# Altium project Lathe_mainboard.PrjPcb
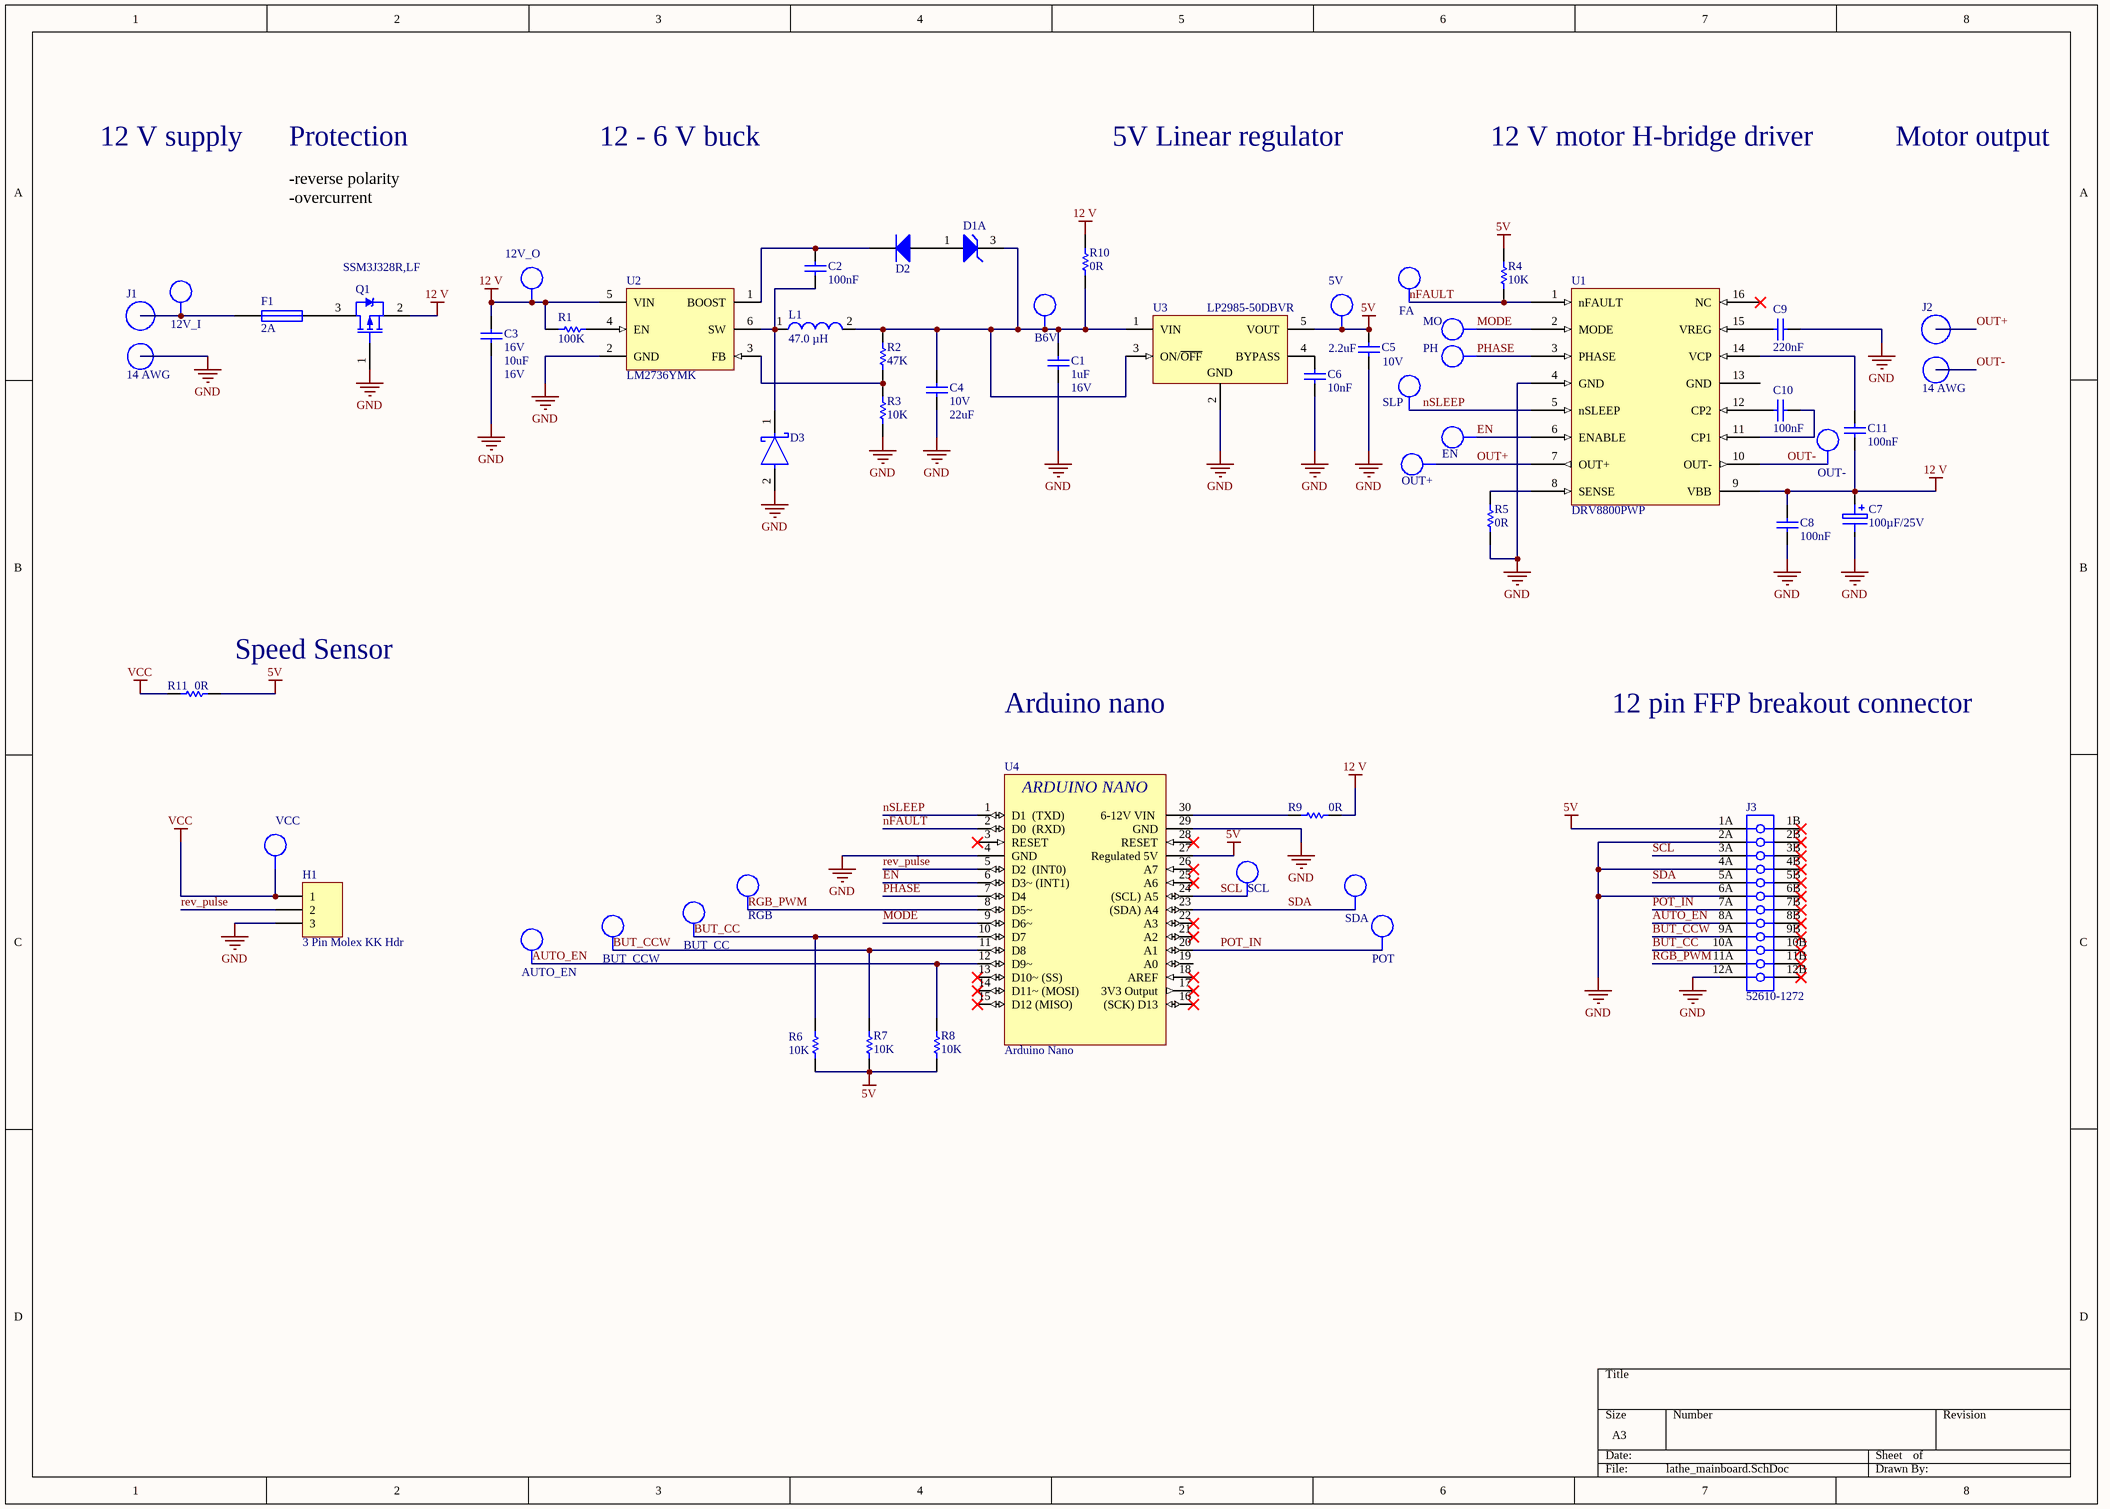
[diagram p0: lathe_mainboard.SchDoc]
1 sheet, 55 parts. Net scope: global (net labels, ports and power ports of the same name join across sheets).
Board file: lathe_pcb.PcbDoc

## Sheet lathe_mainboard.SchDoc
size A3; SheetNumber: 1; SheetTotal: 1; SPICEModelCacheIQLMAAGZ: <root> / <DocumentId>IQLMAAGZ</DocumentId> / <CacheFrame Number="0"> / <Model Name="cap" Kind="MDL"> / <Text>*Default semiconductor capacitor / .MODEL CAP C()</Text> / </Model> / </CacheFrame> / </root>

### Parts
5V  TP  [TP_1206]  (value not drawn)  (no BOM)
12V_I  TP  [TP_1206]  (value not drawn)  (no BOM)
12V_O  TP  [TP_1206]  (value not drawn)  (no BOM)
AUTO_EN  TP  [TP_1206]  (value not drawn)  (no BOM)
B6V  TP  [TP_1206]  (value not drawn)  (no BOM)
BUT_CC  TP  [TP_1206]  (value not drawn)  (no BOM)
BUT_CCW  TP  [TP_1206]  (value not drawn)  (no BOM)
C1  Max Voltage: 16V  [CAPC1608L]  (hidden comment: 1uF)
C2  100nF  [CAPC1608L]
C3  Voltage - Rated: 16V  [CAPC2012L]  (hidden comment: 10uF)
C4  Max Voltage: 10V  [CAPC3216L]  (hidden comment: 22uF)
C5  Max Voltage: 10V  [CAPC1608L]  (hidden comment: 2.2uF)
C6  10nF  [CAPC1608L]
C7  100µF/25V  [CAPAE6666X77M]
C8  100nF  [CAPC1608L]
C9  220nF  [CAPC1608L]
C10  100nF  [CAPC1608L]
C11  100nF  [CAPC1608L]
D1  BZX84C4V3LT1G  [ONSC-SOT-23-3-318-08_V]  (value not drawn)  (part A of 2)
D2  1N4148W-7-F  [DIOD-SOD123-2_V]  (value not drawn)
D3  MSS1P3L-M3/89A  [FP-96591-MFG]  (value not drawn)
EN  TP  [TP_1206]  (value not drawn)  (no BOM)
F1  value 2A  [RESC3216N]  (hidden comment: 1A)
FA  TP  [TP_1206]  (value not drawn)  (no BOM)
H1  3 Pin Molex KK Hdr  [MOLEX_KK_3_HDR]
J1  14 AWG  [14AWG_holes]
J2  14 AWG  [14AWG_holes]
J3  52610-1272  [MOLX-52610-1272]
L1  47.0 µH  [WE-PD-L]
MO  TP  [TP_1206]  (value not drawn)  (no BOM)
OUT+  TP  [TP_1206]  (value not drawn)  (no BOM)
OUT-  TP  [TP_1206]  (value not drawn)  (no BOM)
PH  TP  [TP_1206]  (value not drawn)  (no BOM)
POT  TP  [TP_1206]  (value not drawn)  (no BOM)
Q1  SSM3J328R,LF  [SOT23_L]
R1  100K  [RESC1608L]
R2  47K  [RESC1608N]
R3  10K  [RESC1608L]
R4  10K  [RESC1608L]
R5  0R  [RESC1608L]
R6  10K  [RESC1608L]
R7  10K  [RESC1608L]
R8  10K  [RESC1608L]
R9  0R  [RESC1608L]
R10  0R  [RESC1608L]
R11  0R  [RESC1608L]
RGB  TP  [TP_1206]  (value not drawn)  (no BOM)
SCL  TP  [TP_1206]  (value not drawn)  (no BOM)
SDA  TP  [TP_1206]  (value not drawn)  (no BOM)
SLP  TP  [TP_1206]  (value not drawn)  (no BOM)
U1  DRV8800PWP  [SOP65P640X120-17N]
U2  LM2736YMK  [DDC0006A_L]
U3  LP2985-50DBVR  [DBV0005A_M]
U4  Arduino Nano  [Arduino-nano]
VCC  TP  [TP_1206]  (value not drawn)  (no BOM)

### Nets
5V: 5V.1 C5.2 J3.1A R4.2 R6.1 R7.1 R8.1 R11.2 U3.5(VOUT) U4.27(Regulated_5V)
12 V: 12V_O.1 C3.2 C7.2 C8.2 C11.1 Q1.2 R1.2 R9.2 R10.2 U1.9(VBB) U2.5(VIN)
GND: C1.1 C3.1 C4.1 C5.1 C6.1 C7.1 C8.1 C9.2 D3.2(A) H1.3 J1.2 J3.2A J3.4A J3.6A J3.12A Q1.1 R3.1 R5.1 U1.4(GND) U2.2(GND) U3.2(GND) U4.4(GND) U4.29(GND)
VCC: H1.1 R11.1 VCC.1
AUTO_EN: AUTO_EN.1 J3.8A R8.2 U4.12(D9~)
BUT_CC: BUT_CC.1 J3.10A R6.2 U4.10(D7)
BUT_CCW: BUT_CCW.1 J3.9A R7.2 U4.11(D8)
EN: EN.1 U1.6(ENABLE) U4.6(D3~_(INT1))
MODE: MO.1 U1.2(MODE) U4.9(D6~)
nFAULT: FA.1 R4.1 U1.1(nFAULT) U4.2(D0__(RXD))
nSLEEP: SLP.1 U1.5(nSLEEP) U4.1(D1__(TXD))
OUT+: J2.1 OUT+.1 U1.7(OUT+)
OUT-: J2.2 OUT-.1 U1.10(OUT-)
PHASE: PH.1 U1.3(PHASE) U4.7(D4)
POT_IN: J3.7A POT.1 U4.20(A1)
rev_pulse: H1.2 U4.5(D2__(INT0))
RGB_PWM: J3.11A RGB.1 U4.8(D5~)
SCL: J3.3A SCL.1 U4.24((SCL)_A5)
SDA: J3.5A SDA.1 U4.23((SDA)_A4)
Net12V_I_1: 12V_I.1 F1.1 J1.1
NetB6V_1: B6V.1 C1.2 C4.2 D1.3(K) L1.2 R2.2 R10.1 U3.1(VIN) U3.3(ON/~{OFF})
NetC2_1: C2.1 D2.2(K) U2.1(BOOST)
NetC2_2: C2.2 D3.1(C) L1.1 U2.6(SW)
NetC6_2: C6.2 U3.4(BYPASS)
NetC9_1: C9.1 U1.15(VREG)
NetC10_1: C10.1 U1.11(CP1)
NetC10_2: C10.2 U1.12(CP2)
NetC11_2: C11.2 U1.14(VCP)
NetD1_1: D1.1(A) D2.1(A)
NetF1_2: F1.2 Q1.3
NetR1_1: R1.1 U2.4(EN)
NetR2_1: R2.1 R3.2 U2.3(FB)
NetR5_2: R5.2 U1.8(SENSE)
NetR9_1: R9.1 U4.30(6-12V_VIN)

Not connected (* = marked no-connect by the designer): J3 1B* 2B* 3B* 4B* 5B* 6B* 7B* 8B* 9B* 10B* 11B* 12B*; U1 13(GND) 16(NC)*; U4 3(RESET)* 13(D10~_(SS))* 14(D11~_(MOSI))* 15(D12_(MISO))* 16((SCK)_D13)* 17(3V3_Output)* 18(AREF)* 19(A0) 21(A2)* 22(A3)* 25(A6)* 26(A7)* 28(RESET)*

### Notes on the sheet
- 12 V supply
- Protection
- 12 - 6 V buck
- 5V Linear regulator
- 12 V motor H-bridge driver
- Motor output
- -reverse polarity
  -overcurrent
- (near R11) Speed Sensor
- Arduino nano
- 12 pin FFP breakout connector
- (in symbol Arduino Nano) ARDUINO NANO

### Library data of the parts
5V 12V_I 12V_O AUTO_EN B6V BUT_CC BUT_CCW EN FA MO OUT+ OUT- PH POT RGB SCL SDA SLP VCC = TP_1206: Test-Point 3.3x1.6x2.1mm SMD; Manufacturer: Harwin Inc; Manufacturer Part Number: S1751-46R; Manufacturer PN: *; Storage Location: ProtoPlace; Mounting Type: Surface Mount; Type: PC Test Point; Supplier 1: Digi-Key; Supplier Part Number 1: 952-1478-2-ND; Supplier 2: Farnell; Supplier Part Number 2: 1826282; Supplier: ECE Dept; Value: TP
C1 = CC_1uF_0603: CAP CER 1uF Y5V -20% +80% 16V 0603; PackageReference: 0603; Code_IPC: 1608 [0603]; Verify: *; Supplier: ECE Dept; Storage Location: PCB Assembly WS; Value: 1uF
C2 C8 C10 C11 = CC_100nF_0603: CAP CER 100nF X7R +-10% 50V 0603; PackageReference: 0603; Code_IPC: 1608 [0603]; Verify: *; Supplier: ECE Dept; Storage Location: PCB Assembly WS; Value: 100nF
C3 = CC_10uF_0805_16V: CAP CER 10uF X5R 16V 0805; Manufacturer: Samsung Electro-Mechanics; Manufacturer Part Number: CL21A106KOQNNWE; Note: Footprint corresponds to dimensions for bulk cassette packaging. This case size has tightened tolerances.; Tolerance: ±10%; Notification: Current market demand for these product types have resulted in fluctuating and extending lead times. Lead times may differ.; PackageReference: 0805; Code_IPC: 2012[0805]; Supplier 1: Digi-Key; RoHS: RoHS Compliant; Category: Capacitors; Stock 1: 20000; Pricing 1: 1=0.35, 10=0.25, 100=0.1178, 500=0.08254, 1000=0.06831 (NZD); Packaging: Cut Tape (CT); Part Status: Active; Temperature Coefficient: X5R; Operating Temperature: -55°C ~ 85°C; Features: -; Ratings: -; Applications: General Purpose; Mounting Type: Surface Mount, MLCC; Package / Case: 0805 (2012 Metric); Size / Dimension: 0.079" L x 0.049" W (2.00mm x 1.25mm); Height - Seated (Max): -; Thickness (Max): 0.055" (1.40mm); Lead Spacing: -; Lead Style: -; ComponentLink1URL: http://www.samsungsem.com/kr/support/product-search/mlcc/CL21A106KOQNNWE.jsp; ComponentLink1Description: http://www.samsungsem.com/kr/support/product-search/mlcc/CL21A106KOQNNWE.jsp; Supplier Part Number 1: 1276-2894-1-ND; Value: 10uF; Max Voltage: 16V
C4 = CC_22uF_1206: CAP CER 22uF Y5V -20% +80% 10V 1206; Verify: *; Supplier: ECE Dept; Storage Location: PCB Assembly WS; Dielectric: Y5V; Footprint: 1206 (3216 metric); Value: 22uF
C5 = CC_2.2uF_0603: CAP CER 2.2uF X5R +-20% 10V 0603; PackageReference: 0603; Code_IPC: 1608 [0603]; Verify: *; Supplier: ECE Dept; Storage Location: PCB Assembly WS; Value: 2.2uF
C6 = CC_10nF_0603: CAP CER 10nF X7R +-10% 50V 0603; PackageReference: 0603; Code_IPC: 1608 [0603]; Verify: *; Supplier: ECE Dept; Storage Location: PCB Assembly WS; Value: 10nF
C7 = CA_100uF_25V: CAP ALUM 100UF 25V 20% SMD; Manufacturer: Nichicon; Manufacturer Part Number: UWT1E101MCL1GS; Ripple Current: 91mA; Supplier 1: Digi-Key; Height - Seated (Max): 0.303" (7.70mm); Mounting Type: Surface Mount; Operating Temperature: -55°C ~ 105°C; Package / Case: Radial, Can - SMD; Size / Dimension: 0.248" Dia (6.30mm); Supplier Part Number 1: 493-2190-1-ND; Capacitance: 100µF/25V
C9 = CC_220nF_0603: CAP CER 220nF Y5V -20% +80% 25V 0603; PackageReference: 0603; Code_IPC: 1608 [0603]; Verify: *; Supplier: ECE Dept; Storage Location: PCB Assembly WS; MoV: 25V; Value: 220nF
D1 = CMP-1060-01162-1: Zener Voltage Regulator, 225 mW, 3-Pin SOT-23, Pb-Free, Tape and Reel; Manufacturer: On Semiconductor; ComponentLink3Description: Package Specification; Mounting Technology: Surface Mount; ComponentLink3URL: http://www.onsemi.cn/pub_link/Collateral/318-08.PDF; Packing: Tape and Reel; PackageReference: SOT-23-3-318-08; PackageDescription: 3-Pin Small Outline Transistor, Body 2.92 x 1.3 mm, Pitch 0.95 mm; ComponentLink1URL: http://www.onsemi.com/; PartNumber: BZX84C4V3LT1G; RoHS: Pb-Free; ComponentLink1Description: Manufacturer URL; DatasheetVersion: Rev. 17; ComponentLink2URL: http://www.onsemi.com/pub_link/Collateral/BZX84C2V4LT1-D.PDF; ComponentLink2Description: Datasheet; PackageVersion: Rev. AP, 11/2009
D2 = CMP-2000-04932-2: Fast Switching Diode, 100 V, 0.15 A, -65 to 150 degC, 2-Pin?SOD123, RoHS, Tape and Reel; Recovery Time: 4ns; Brand: DiodesIncorporated; Unit Weight: 0.000353oz; Max Surge Current: 2A; Peak Reverse Voltage: 100V; Ir - Reverse Current: 1uA; Vf - Forward Voltage: 1.25V; Configuration: Single; If - Forward Current: 0.15A; Product Category: Diodes-GeneralPurpose,Power,Switching; Operating Temperature Range: -65Cto+150C; Packaging: Reel; Manufacturer URL: http://www.diodes.com/; Maximum Operating Temperature: +150C; Height: 1.25mm; Minimum Operating Temperature: -65C; Product: SwitchingDiodes; Package URL: http://www.diodes.com/datasheets/ds18004.pdf; Type: SwitchingDiode; Package Reference: SOD123-2; Width: 1.7mm; Datasheet URL: http://www.farnell.com/datasheets/1915529.pdf; Datasheet Version: Rev. 24-2, 10/2013; Series: 1N4148; Factory Pack Quantity: 3000; Length: 2.85mm; RoHS: True; Manufacturer: DiodesIncorporated; Mounting Style: SMD/SMT; Package / Case: SOD-123
D3 = CMP-02539-000006-1: DIODE SCHOTTKY 30V 1A MICROSMP; Manufacturer: Vishay; Max Junction Temp: +150°C; Max Surge Forward Current: 25A; Value: 65pF; Peak Reverse Current: 15uA; Max Repetitive Reverse Voltage: 30V; Mouser Description: Schottky Diodes & Rectifiers 1.0 Amp 30 Volt; Device Class L2: Diodes; RoHS: TRUE; Temperature Range Low: -55°C; ComponentLink2URL: http://www.vishay.com/docs/89020/mss1p3l.pdf; Octopart: https://octopart.com/mss1p3l-m3%2F89a-vishay-42670898; Automotive: No; Height: 0.73mm; Temperature: -55°C to +150°C; Temperature Range High: +150°C; ComponentLink2Description: Datasheet; Lead Free: Yes; Digikey Description: DIODE SCHOTTKY 30V 1A MICROSMP; Forward Current: 1A; Manufacturer Part Number: MSS1P3L-M3/89A; Footprint Url: http://www.vishay.com/docs/96591/microsmp_do-219ad_fredpt.pdf; Device Class L1: Discrete Semiconductors; Capacitance: 65pF; Device Class L3: Schottky Diodes; Package: 96591; Category: Diode
F1 = FS_Fuse_2.0A: Fuse 2.0A Very Fast Acting 1206 SMD; Manufacturer: MULTICOMP; Manufacturer PN: MC12CF 002; Supplier: ECE Dept; Storage Location: PCB Assembly WS; Supplier 1: Farnell; Supplier Part Number 1: 1841029; Manufacturer Part Number: MC12CF 002
H1 = JA_MOLEX_KK_3POS: CONN HEADER 3POS 2.54mm VERT_Thru Hole; Manufacturer: Molex; Manufacturer PN: 22-23-2031; Supplier Part Number 1: 9731156; Supplier: ECE Dept; Supplier 1: Farnell; Storage Location: ECE Dept Store; Value: 3 Pin Molex KK Hdr
J1 J2 = 14AWG_holle
J3 = CMP-1241-00323-1: 1.0 mm Pitch Easy-On(TM) Type FPC Connector, 5.75 mm Mated Height, Vertical, ZIF, SMT, 12 Circuits, -40 to 85 degC, ELV and RoHS Compliant, Tape and Reel; Manufacturer: Molex; PCB Retention: None; Material - Metal: Phosphor Bronze; PCB Locator: No; Current (Max per Contact): 1A; Material - Plating Mating: Gold; Circuits (Loaded): 12; Material - Plating Termination: Tin; Pitch - Mating Interface: 1.00mm; Mated Height: 5.75mm; Durability (mating cycles max): 30; Voltage (Max): 125V AC (RMS)/DC; ComponentLink2URL: http://www.molex.com/webdocs/datasheets/pdf/en-us/0526101272_FFC_FPC_CONNECTORS.pdf; Orientation: Vertical; PackageDescription: 12-Lead FPC Connector, Pitch 1.0 mm; ComponentLink2Description: Datasheet; Polarized to PCB: No; ComponentLink1Description: Manufacturer URL; Entry Angle: Vertical; PartNumber: 52610-1272; PackageReference: 52610-1272; Contact Position: N/A; Mounting Technology: Surface Mount; Stackable: No; ComponentLink3URL: http://www.molex.com/pdm_docs/sd/526101272_sd.pdf; ComponentLink1URL: http://www.molex.com/molex/index.jsp; Number of Rows: 1; RoHS: TRUE; PackageVersion: Rev. G, 02/2012; Packing: Tape and Reel; ComponentLink3Description: Package Specification
L1 = CMP-0227-00728-1: SMD-Shielded Power Inductor WE-PD, L = 47.0 µH; Inductance: 47.0 ÂµH; PackageReference: WE-PD-L; PackageVersion: 2006; ComponentLink1URL: http://www.we-online.com; ComponentLink2Description: Datasheet; PackageDescription: SMD Inductor, 2-Leads, Body 12.0 x 12.0 mm; ComponentLink2URL: http://www.we-online.de/katalog/media/pdf/744771147.pdf; ComponentLink1Description: Manufacturer Link; DatasheetVersion: ver 6, Jun-2005
Q1 = TM_SSM3J328R: MOSFET P-CH 20V 6A SOT23-3; Manufacturer: Toshiba; FET Feature: Logic Level Gate, 1.5V Drive; FET Type: MOSFET P-Channel, Metal Oxide; Gate Charge (Qg) @ Vgs: 12.8nC @ 4.5V; Input Capacitance (Ciss) @ Vds: 840pF @ 10V; Power - Max: 1W; Rds On Max: 29.8mR; Drain to Source Resistance: 47.4mR; Turn-On Delay Time: 32ns; Power Dissipation: 2W; Number of Channels: 1; Turn-Off Delay Time: 107ns; Gate to Source Voltage (Vgs): 8V; Input Capacitance: 840pF; Element Configuration: Single; Drain to Source Breakdown Voltage: -20V; Vgs(th) (Max) @ Id: 1V @ 1mA; Current - Continuous Drain (Id) @ 25° C: 6A; Drain to Source Voltage (Vdss): 20V; Package / Case: SOT-23-3 Flat Leads; Supplier Device Package: SOT-23F; Pricing: 1=0.79, 10=0.658, 25=0.5772, 100=0.4939, 250=0.42836, 500=0.36284, 1000=0.27972 (NZD); Storage Location: PCB Assembly WS; Supplier: Digi-Key; ComponentLink1URL: https://datasheet.ciiva.com/11158/ssm3j328r-datasheet-en-20140301-11158652.pdf; ComponentLink1Description: https://datasheet.ciiva.com/11158/ssm3j328r-datasheet-en-20140301-11158652.pdf; Supplier Part Number: SSM3J328RLFDKR-ND; Max Operating Temperature: 150°C; Mount: Surface Mount; Packaging: Tape and Reel; Min Operating Temperature: -55°C; Continuous Drain Current (ID): 6A; Radiation Hardening: No; Max Power Dissipation: 1W; Package Quantity: 3000; Case/Package: SOT-23-3; Number of Pins: 3; Number of Elements: 1; Supplier 1: Digi-Key; Supplier Part Number 1: SSM3J328RLFDKR-ND; Manufacturer Part Number: SSM3J328R,LF
R1 = RS_100K: RES 100K OHM 1/10W 5% 0603 SMD; Storage Location: PCB Assembly WS; Supplier: ECE Dept; Value: 100K
R2 = RS_47K: RES 47.0K OHM 1/10W 5% 0603 SMD; Storage Location: PCB Assembly WS; Supplier: ECE Dept; Value: 47K
R3 R4 R6-R8 = RS_10K: RES 10.0K OHM 1/10W 5% 0603 SMD; Storage Location: PCB Assembly WS; Supplier: ECE Dept; Value: 10K
R5 R9-R11 = RS_0R0: RES 0.0 OHM 1/10W 5% 0603 SMD; Storage Location: PCB Assembly WS; Supplier: ECE Dept; Value: 0R
U1 = DRV8800PWP: IC MTR DRV BIPOLR 8-38V 16HTSSOP
U2 = CMP-0069-01247-3: 750mA Load Step-Down DC-DC Regulator, 6-pin Tiny SOT23; Manufacturer: Texas Instruments; PackageTopMarking: SHBB*XTT; CompType: Switcher; PowerWise: N; PinCount: 6; ComponentLink1URL: http://www.ti.com/general/docs/lit/getliterature.tsp?genericPartNumber=LM2736&fileType=pdf; PackageReference: DDC0006A; Code_IPC: SOT26A-6; ComponentLink1Description: Datasheet URL; Code_JEDEC: MO-193-AA; PackageDescription: Molded TSOT, 2.97 x 1.65 x 0.87mm Body, 6 Lead, 0.95mm Pitch; RoHS: N
U3 = LP2985-50DBVR: Single Output Low Noise LDO, 150 mA, Fixed 5 V Output, 1.5% Tolerance, 2.2 to 16 V Input, Low IQ, 5-Pin SOT-23 (DBV), -40 to 125 degC, Green (RoHS & no Sb/Br), Tape and Reel; Manufacturer: Texas Instruments; Accuracy (%): 1.5; Iout (Max) (A): 0.15; Fixed Output Options (V): 5; Vdo (Typ) (mV): 280; Output Options: Fixed Output; Iq (Typ) (mA): 0.85; DatasheetVersion: SLVS522N; PackageDescription: 5-Pin Plastic Small Outline, Body 2.9 x 1.6 mm, Pitch 0.95 mm; RoHS: TRUE; ComponentLink3URL: http://www.ti.com/litv/pdf/mpds018j; PartNumber: LP2985-50DBVR; PackageReference: DBV0005A; ComponentLink2URL: http://www.ti.com/lit/ds/symlink/lp2985-50.pdf; Mounting Technology: Surface Mount; ComponentLink1Description: Manufacturer URL; Vin (V): 2.2 to 16; ComponentLink3Description: Package Specification; ComponentLink1URL: http://www.ti.com/; PackageVersion: 4073253-4/L; ComponentLink2Description: Datasheet; Packing: Tape and Reel; Operating Temperature Range (degC): -40 to 125